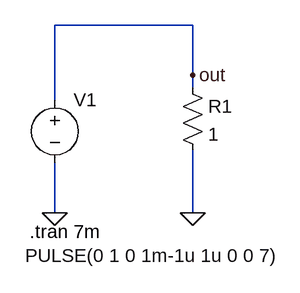
[diagram p0: schematic hw1_6.asc]
hw1_6.asc, the LTspice schematic file:
Version 4
SHEET 1 880 680
WIRE 272 0 96 0
WIRE 272 64 272 0
WIRE 272 80 272 64
WIRE 96 96 96 0
WIRE 96 240 96 176
WIRE 272 240 272 160
WIRE 288 240 272 240
FLAG 96 240 0
FLAG 272 240 0
FLAG 272 64 out
SYMBOL res 256 64 R0
SYMATTR InstName R1
SYMATTR Value 1
SYMBOL voltage 96 80 R0
WINDOW 3 -38 215 Left 2
WINDOW 123 0 0 Left 0
WINDOW 39 0 0 Left 0
SYMATTR Value PULSE(0 1 0 1m-1u 1u 0 0 7)
SYMATTR InstName V1
TEXT 64 264 Left 2 !.tran 7m

The netlist it stands for:
* hw1_6.asc
R1 out 0 1
V1 out 0 PULSE(0 1 0 1m-1u 1u 0 0 7)
.tran 7m
.backanno
.end

* Results of the author's LTspice run, read from the files saved beside the schematic
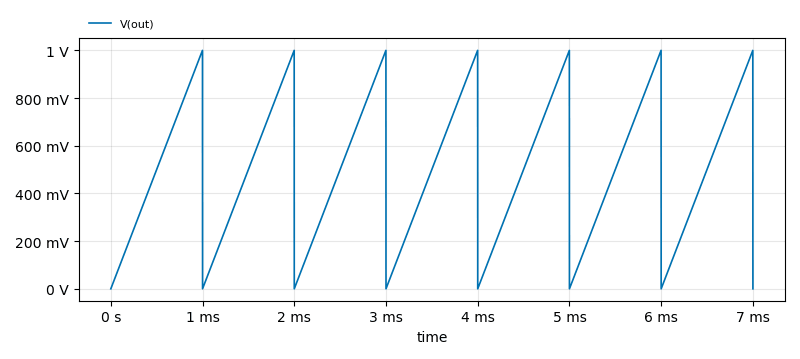
[diagram p1: Transient Analysis of hw1_6.asc, plotted from the saved traces]
* Transient Analysis, 1 run:
*   V(out): min 0 V, max 1 V, average 500 mV, rms 699.1 mV, last 0 V